# EasyEDA Pro project 学期项目.epro, board PCB3
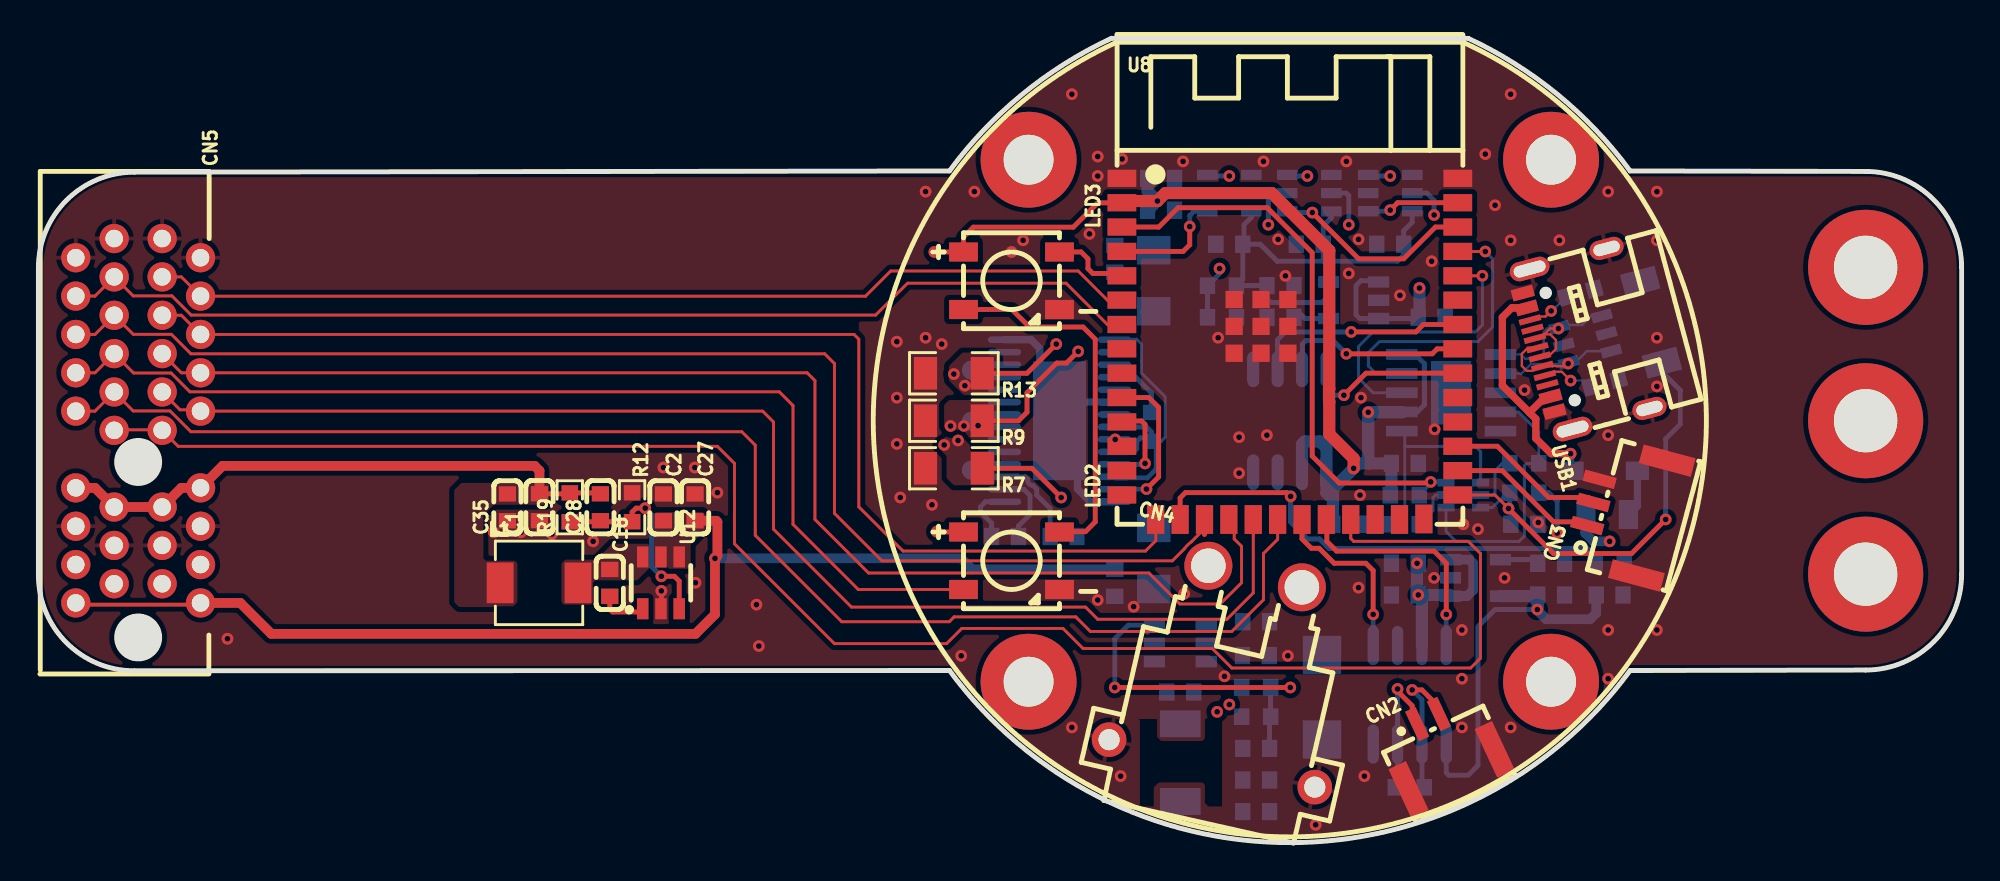
[diagram p15: board, top side]
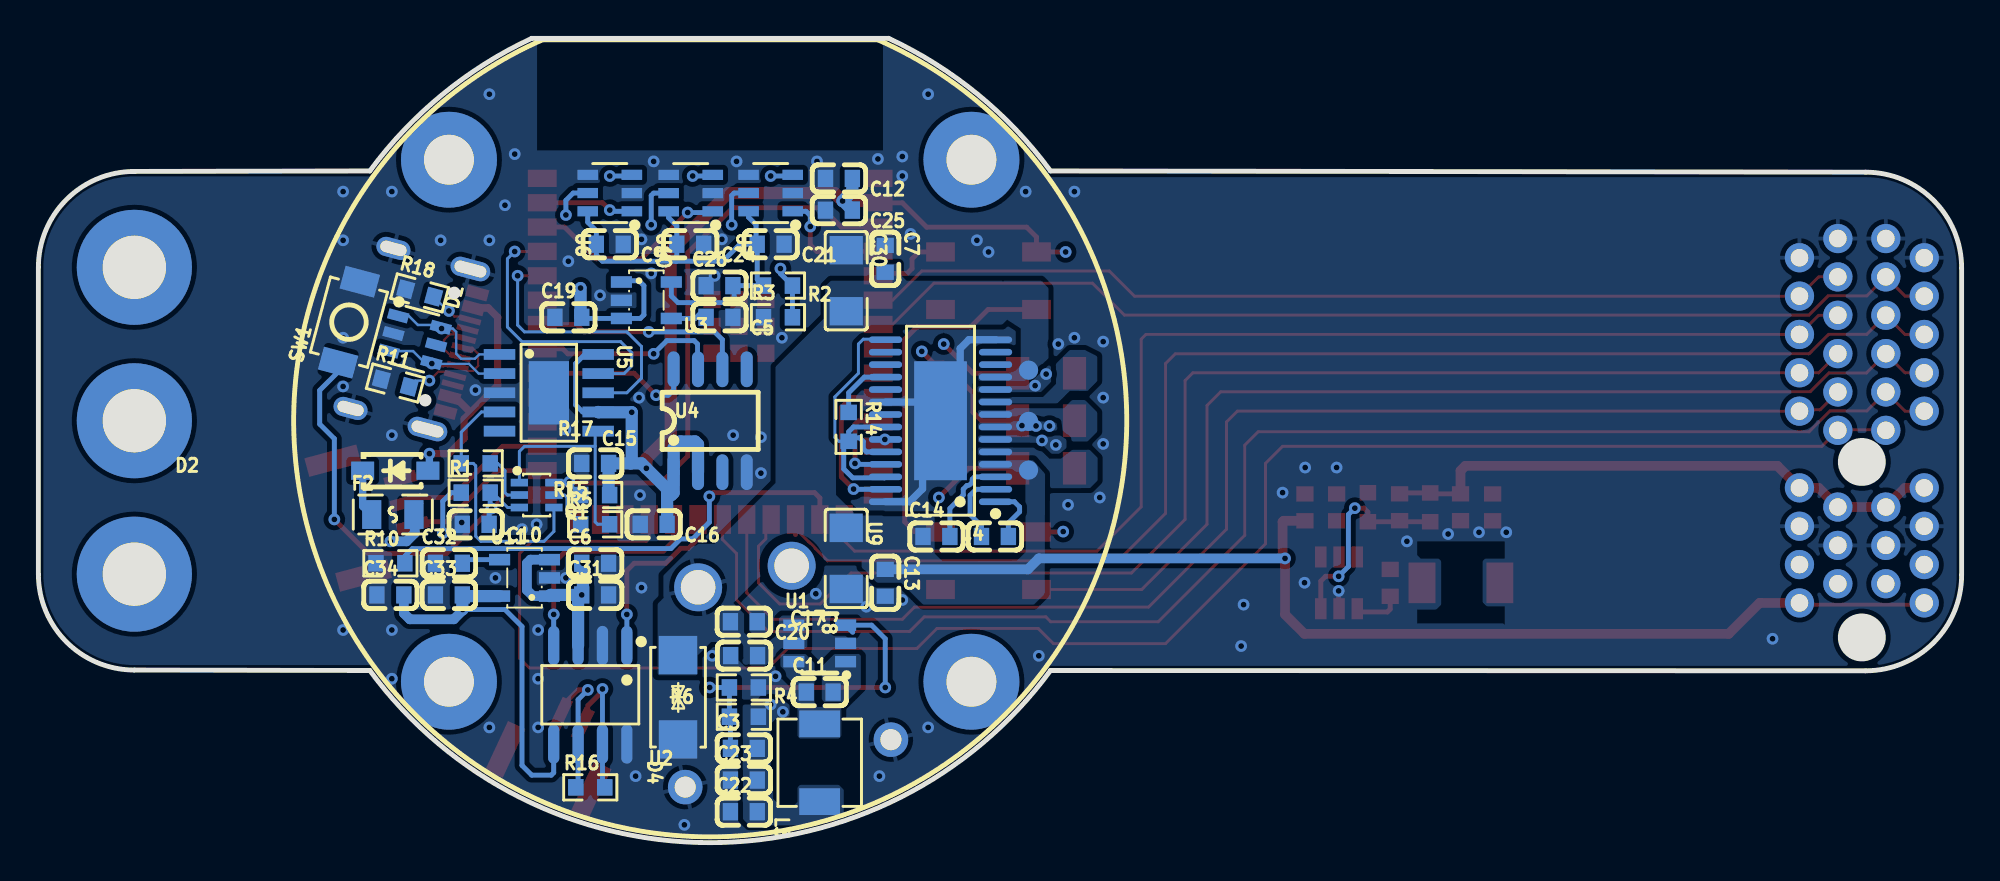
[diagram p16: board, bottom side, seen from below]

Outline 100.2 x 41.94 mm; copper layers: Top Layer, Inner1, Inner2, Bottom Layer. Coordinates in mm from the lower left corner of the outline.
Outline path: 0,29.96 arc(1.46,33.5) 5,34.96 47.47,35.02 arc(51.25,39.01) 55.9,41.94 74.5,41.94 arc(79.15,39.01) 82.93,35.02 95.2,35 arc(98.73,33.54) 100.2,30 100.2,14 arc(98.73,10.46) 95.2,9 82.93,8.98 arc(65.2,0) 47.47,8.98 5,8.96 arc(1.46,10.43) 0,13.96 0,29.96
Stack: Top Layer 0.035mm Outer layer thickness 1oz / Dielectric1 0.2104mm 7628 RC49% 8.6mil / Inner1 0.0152mm Inner layer thickness / Dielectric2 1.065mm 1.1mm H/HOZ Copper / Inner2 0.0152mm Inner layer thickness / Dielectric3 0.2104mm 7628 RC49% 8.6mil / Bottom Layer 0.035mm Outer layer thickness 1oz

## Design rules (mm)
spacing copperThickness1oz (default): track to track 0.102, other pairs 0.152 to 0.3
spacing copperThickness2oz: track to track 0.203, other pairs 0.152 to 0.3
track width copperThickness1oz (default): min 0.102, default 0.254, max 2.54
track width copperThickness2oz: min 0.203, default 0.254, max 2.54
differential pair differentialPair (default): width min 0.127, default 0.254, max 2.54; gap min 0.152, default 0.152
net GND uses copperRegion

## Placement (name value [footprint] x y rotation side)
C1  10uF  [C0603]  26.11 17.49 90 top
C2  100nF  [C0603]  32.56 17.48 270 top
C3  100pF  [C0603]  63.44 4.92 180 bottom
C4  10nF  [C0603]  50.36 15.97 180 bottom
C5  -  [C0603]  64.71 27.4 0 bottom
C6  100nF  [C0603]  71.19 14.57 180 bottom
C7  100nF  [C0603]  56.08 30.44 270 bottom
C8  100uF  [C1206]  58.11 14.82 90 bottom
C9  100nF  [C0603]  70.43 31.21 0 bottom
C10  1uF  [C0603]  77.41 16.6 0 bottom
C11  100nF  [C0603]  59.49 7.85 180 bottom
C12  10uF  [C0603]  58.49 34.63 0 bottom
C13  100nF  [C0603]  56.08 13.55 270 bottom
C14  100nF  [C0603]  53.41 15.97 180 bottom
C15  100nF  [C0603]  71.19 19.78 180 bottom
C16  100nF  [C0603]  68.14 16.6 0 bottom
C17  100nF  [C0603]  63.43 9.76 180 bottom
C18  100nF  [C0603]  29.77 13.55 270 top
C19  1uF  [C0603]  72.59 27.4 180 bottom
C20  22uF  [C0603]  63.44 11.52 0 bottom
C21  100nF  [C0603]  62.05 31.21 0 bottom
C22  100nF  [C0603]  63.44 1.61 180 bottom
C23  10uF  [C0603]  63.44 3.27 180 bottom
C24  100nF  [C0603]  66.24 31.21 0 bottom
C25  100nF  [C0603]  58.49 32.98 0 bottom
C26  -  [C0603]  64.71 29.05 180 bottom
C27  22uF  [C0603]  34.21 17.48 270 top
C28  100pF  [C0603]  29.28 17.49 90 top
C30  100uF  [C1206]  58.11 29.3 270 bottom
C31  10uF  [C0603]  71.19 12.92 180 bottom
C32  -  [C0603]  78.81 14.57 180 bottom
C33  100nF  [C0603]  78.81 12.92 180 bottom
C34  -  [C0603]  81.86 12.92 180 bottom
C35  100nF  [C0603]  24.43 17.48 90 top
CN2  WAFER-GH1.25-2PWB  [CONN-TH_2P-P1.25_XUNPU_WAFER-GH1.25-2PWB]  73.01 5.13 25 top
CN3  WAFER-GH1.25-3PWB  [CONN-TH_3P-P1.25_GH1.25]  82.54 17.33 75 top
CN4  XT30PW-M30.G.Y  [CONN-TH_XT30PW-M]  62.27 9 347 top
CN5  3183-10110P1T  [CONN-TH_36P-P1.00-V_3183-XXXXXPXT]  5.2 22 270 top
D1  USBLC6-2SC6  [SOT-23-6_L2.9-W1.6-P0.95-LS2.8-BL]  80.59 26.25 285 bottom
D2  B5819W SL  [SOD-123_L2.7-W1.6-LS3.7-RD-1]  81.61 19.39 180 bottom
D4  SMAJ40CA  [SMA_L4.3-W2.6-LS5.0-BI]  66.87 7.58 90 bottom
F2  JK-SMD0805-100  [F0805]  81.73 17.11 180 bottom
L1  10uH  [IND-SMD_L4.4-W4.2]  26.09 13.55 0 top
L3  10uH  [IND-SMD_L4.4-W4.2]  59.49 4.17 90 bottom
LED2  XL-5050RGBC-WS2812B  [LED-SMD_4P-L5.0-W5.0-BL_XL-5050RGBC]  50.7 14.7 270 top
LED3  XL-5050RGBC-WS2812B  [LED-SMD_4P-L5.0-W5.0-BL_XL-5050RGBC]  50.7 29.3 270 top
MARK2  -  [Mark-Point-1mm]  46.07 24.64 180 bottom
MARK3  -  [Mark-Point-1mm]  46.07 19.42 180 bottom
MARK4  -  [Mark-Point-1mm]  46.07 21.97 180 bottom
NOREF  -  [Pad_e678]  78.81 8.39 0 top
NOREF#2  -  [Pad_e679]  95.2 14 0 top
NOREF#3  -  [Pad_e676]  51.59 8.39 0 top
NOREF#4  -  [Pad_e681]  95.2 22 0 top
NOREF#5  -  [Pad_e677]  78.81 35.61 0 top
NOREF#6  -  [Pad_e680]  95.2 30 0 top
NOREF#7  -  [Pad_e675]  51.59 35.61 0 top
Q1  LMBT3904DW1T1G  [SOT-363_L2.0-W1.3-P0.65-LS2.1-BR]  74.24 18.12 0 bottom
R1  10kΩ  [R0603]  77.41 18.25 180 bottom
R2  1K  [R0603]  61.67 29.05 0 bottom
R3  1K  [R0603]  61.67 27.4 180 bottom
R4  3K  [R0603]  63.44 8.09 0 bottom
R5  10kΩ  [R0603]  71.19 16.6 180 bottom
R6  22K  [R0603]  63.44 6.57 180 bottom
R7  50mΩ  [R1206]  47.7 19.52 180 top
R9  50mΩ  [R1206]  47.7 22 180 top
R10  10kΩ  [R0603]  81.86 14.57 180 bottom
R11  5.1K  [R0603]  81.61 23.97 195 bottom
R12  10K  [R0603]  30.93 17.49 270 top
R13  50mΩ  [R1206]  47.7 24.47 180 top
R14  10K  [R0603]  57.98 21.68 270 bottom
R15  10kΩ  [R0603]  71.19 18.12 0 bottom
R16  120  [R0603]  71.45 2.88 180 bottom
R17  10kΩ  [R0603]  77.41 19.78 0 bottom
R18  5.1K  [R0603]  80.33 28.67 195 bottom
R19  43K  [R0603]  27.68 17.48 90 top
SW1  TS-1088-AR02016  [SW-SMD_L3.9-W3.0-P4.45]  84.02 27.14 105 bottom
U1  ME3121AM6G  [SOT-23-6_L2.9-W1.6-P0.95-LS2.8-BR]  59.49 10.39 180 bottom
U2  TJA1051T/3/1J  [SOIC-8_L4.9-W3.9-P1.27-LS6.0-BL]  71.45 7.71 0 bottom
U3  RS3236-3.3AYF5  [SOT-23-5_L3.0-W1.7-P0.95-LS2.8-BR]  68.52 28.28 0 bottom
U4  MT6701CT-STD  [SOP-8_L4.9-W3.9-P1.27-LS6.0-BL]  65.2 22 180 bottom
U5  CH340K  [ESOP-10_L4.9-W3.9-P1.00-LS6.0-BL-EP]  73.6 23.46 270 bottom
U6  INA181A2IDBVR  [SOT-23-6_L2.9-W1.6-P0.95-LS2.8-BL]  70.43 33.87 90 bottom
U7  INA181A2IDBVR  [SOT-23-6_L2.9-W1.6-P0.95-LS2.8-BL]  62.05 33.87 90 bottom
U8  ESP32-S3-WROOM-1-N16R8  [WIRELM-SMD_ESP32-S3-WROOM-1]  65.2 25.74 0 top
U9  DRV8313PWPR  [HTSSOP-28_L9.8-W4.5-P0.65-LS6.6-BL-EP]  53.2 22 90 bottom
U10  INA181A2IDBVR  [SOT-23-6_L2.9-W1.6-P0.95-LS2.8-BL]  66.21 33.87 90 bottom
U11  RS3236-3.3AYF5  [SOT-23-5_L3.0-W1.7-P0.95-LS2.8-BR]  74.87 13.81 180 bottom
U12  ME3121AM6G  [SOT-23-6_L2.9-W1.6-P0.95-LS2.8-BR]  32.44 13.55 270 top
USB1  TYPEC-304-ACP16  [USB-C-SMD_TYPE-C-16P-1_1]  80.49 26.19 105 top

## Footprints (pads in the part's own frame, mm; a bottom-side part is the same pattern mirrored in y, then rotated)
C0603
  rect 0.8x0.9 smd: 1(-0.7,0) 2(0.7,0)
C1206
  rect 1.485x1.728 smd: 1(-1.593,0) 2(1.593,0)
CONN-TH_2P-P1.25_XUNPU_WAFER-GH1.25-2PWB
  rect 0.6x1.7 smd: 1(-0.625,1.45) 2(0.625,1.45)
  rect 1x2.8 smd: 3(-2.475,-1.45) 4(2.475,-1.45)
CONN-TH_3P-P1.25_GH1.25
  rect 0.6x1.7 smd: 1(-1.25,1.575) 2(0,1.575) 3(1.25,1.575)
  rect 1x2.8 smd: 4(3.1,-1.575) 5(-3.1,-1.575)
CONN-TH_36P-P1.00-V_3183-XXXXXPXT
  round 1.524 hole 0.914: A1(-9.5,1.25) A2(-8.5,3.25) A3(-7.5,1.25) A4(-6.5,3.25) A5(-5.5,1.25) A6(-4.5,3.25) A7(-3.5,1.25) A8(-2.5,3.25) A9(-1.5,1.25) A10(-0.5,3.25) A11(0.5,1.25) A12(3.5,3.25) A13(4.5,1.25) A14(5.5,3.25) A15(6.5,1.25) A16(7.5,3.25) A17(8.5,1.25) A18(9.5,3.25) B1(-9.5,-1.25) B2(-8.5,-3.25) B3(-7.5,-1.25) B4(-6.5,-3.25) B5(-5.5,-1.25) B6(-4.5,-3.25) B7(-3.5,-1.25) B8(-2.5,-3.25) B9(-1.5,-1.25) B10(-0.5,-3.25) B11(0.5,-1.25) B12(3.5,-3.25) B13(4.5,-1.25) B14(5.5,-3.25) B15(6.5,-1.25) B16(7.5,-3.25) B17(8.5,-1.25) B18(9.5,-3.25)
CONN-TH_XT30PW-M
  round 2.5 hole 1.8: 1(-2.5,5) 2(2.5,5)
  round 1.8 hole 1.1: 3(5.5,-5) 4(-5.5,-5)
ESOP-10_L4.9-W3.9-P1.00-LS6.0-BL-EP
  rect 0.56x1.64 smd: 1(-2,-2.57) 2(-1,-2.57) 3(0,-2.57) 4(1,-2.57) 5(2,-2.57) 6(2,2.57) 7(1,2.57) 8(0,2.57) 9(-1,2.57) 10(-2,2.57)
  rect 3.3x2.1 smd: 11(0,0)
F0805
  rect 1x1.5 smd: 1(-1.1,0) 2(1.1,0)
HTSSOP-28_L9.8-W4.5-P0.65-LS6.6-BL-EP
  oval 0.343x1.732 smd: 1(-4.225,-2.866) 2(-3.575,-2.866) 3(-2.925,-2.866) 4(-2.275,-2.866) 5(-1.625,-2.866) 6(-0.975,-2.866) 7(-0.325,-2.866) 8(0.325,-2.866) 9(0.975,-2.866) 10(1.625,-2.866) 11(2.275,-2.866) 12(2.925,-2.866) 13(3.575,-2.866) 14(4.225,-2.866) 15(4.225,2.866) 16(3.575,2.866) 17(2.925,2.866) 18(2.275,2.866) 19(1.625,2.866) 20(0.975,2.866) 21(0.325,2.866) 22(-0.325,2.866) 23(-0.975,2.866) 24(-1.625,2.866) 25(-2.275,2.866) 26(-2.925,2.866) 27(-3.575,2.866) 28(-4.225,2.866)
  rect 6.2x2.75 smd: 29(0,0)
IND-SMD_L4.4-W4.2
  rect 1.4x2.12 smd: 1(2.028,0) 2(-2.028,0)
LED-SMD_4P-L5.0-W5.0-BL_XL-5050RGBC
  rect 1x1.5 smd: 1(-1.5,-2.5) 2(1.5,-2.5) 3(1.5,2.5) 4(-1.5,2.5)
Mark-Point-1mm
  round 1 smd: 1(-2.54,0)
Pad_e675
  round 5 hole 2.6: 1(0,0)
Pad_e676
  round 5 hole 2.6: 1(0,0)
Pad_e677
  round 5 hole 2.6: 1(0,0)
Pad_e678
  round 5 hole 2.6: 1(0,0)
Pad_e679
  round 6 hole 3.3: 1(0,0)
Pad_e680
  round 6 hole 3.3: 1(0,0)
Pad_e681
  round 6 hole 3.3: 1(0,0)
R0603
  rect 0.806x0.864 smd: 1(-0.753,0) 2(0.753,0)
R1206
  rect 1.208x1.701 smd: 1(-1.479,0) 2(1.479,0)
SMA_L4.3-W2.6-LS5.0-BI
  rect 2x2 smd: 1(-2.2,0) 2(2.2,0)
SOD-123_L2.7-W1.6-LS3.7-RD-1
  rect 1.2x0.95 smd: 1(-1.7,0) 2(1.7,0)
SOIC-8_L4.9-W3.9-P1.27-LS6.0-BL
  oval 0.588x2.045 smd: 1(-1.905,-2.57) 2(-0.635,-2.57) 3(0.635,-2.57) 4(1.905,-2.57) 5(1.905,2.57) 6(0.635,2.57) 7(-0.635,2.57) 8(-1.905,2.57)
SOP-8_L4.9-W3.9-P1.27-LS6.0-BL
  oval 0.63x1.865 smd: 1(-1.905,-2.683) 2(-0.635,-2.683) 3(0.635,-2.683) 4(1.905,-2.683) 5(1.905,2.683) 6(0.635,2.683) 7(-0.635,2.683) 8(-1.905,2.683)
SOT-23-5_L3.0-W1.7-P0.95-LS2.8-BR
  rect 1.1x0.6 smd: 1(1.3,-0.95) 2(1.3,0) 3(1.3,0.95) 4(-1.3,0.95) 5(-1.3,-0.95)
SOT-23-6_L2.9-W1.6-P0.95-LS2.8-BL
  rect 0.532x1.072 smd: 1(-0.95,-1.149) 2(0,-1.149) 3(0.95,-1.149) 4(0.95,1.149) 5(0,1.149) 6(-0.95,1.149)
SOT-23-6_L2.9-W1.6-P0.95-LS2.8-BR
  rect 1.1x0.6 smd: 1(1.35,-0.95) 2(1.35,0) 3(1.35,0.95) 4(-1.35,0.95) 5(-1.35,0) 6(-1.35,-0.95)
SOT-363_L2.0-W1.3-P0.65-LS2.1-BR
  rect 0.9x0.4 smd: 1(0.9,-0.65) 2(0.9,0) 3(0.9,0.65) 4(-0.9,0.65) 5(-0.9,0) 6(-0.9,-0.65)
SW-SMD_L3.9-W3.0-P4.45
  rect 1.23x1.86 smd: 1(-2.185,0) 2(2.185,0)
USB-C-SMD_TYPE-C-16P-1_1
  rect 0.6x1.15 smd: A1B12(-3.2,2.41) A4B9(-2.4,2.41) B1A12(3.2,2.41) B4A9(2.4,2.41)
  rect 0.3x1.15 smd: A5(-1.25,2.41) A6(-0.25,2.41) A7(0.25,2.41) A8(1.25,2.41) B5(1.75,2.41) B6(0.75,2.41) B7(-0.75,2.41) B8(-1.75,2.41)
  oval 1x2.1 hole 0.6x1.7: EP(-4.32,1.74) EP(4.32,1.74)
  oval 1x1.8 hole 0.6x1.4: EP(-4.32,-2.41) EP(4.32,-2.41)
WIRELM-SMD_ESP32-S3-WROOM-1
  rect 1.5x0.9 smd: 1(-8.75,8.895) 2(-8.75,7.625) 3(-8.75,6.355) 4(-8.75,5.085) 5(-8.75,3.815) 6(-8.75,2.545) 7(-8.75,1.275) 8(-8.75,0.005) 9(-8.75,-1.265) 10(-8.75,-2.535) 11(-8.75,-3.805) 12(-8.75,-5.075) 13(-8.75,-6.345) 14(-8.75,-7.615) 27(8.75,-7.615) 28(8.75,-6.345) 29(8.75,-5.075) 30(8.75,-3.805) 31(8.75,-2.535) 32(8.75,-1.265) 33(8.75,0.005) 34(8.75,1.275) 35(8.75,2.545) 36(8.75,3.815) 37(8.75,5.085) 38(8.75,6.355) 39(8.75,7.625) 40(8.75,8.895)
  rect 0.9x1.5 smd: 15(-6.985,-8.895) 16(-5.715,-8.895) 17(-4.445,-8.895) 18(-3.175,-8.895) 19(-1.905,-8.895) 20(-0.635,-8.895) 21(0.635,-8.895) 22(1.905,-8.895) 23(3.175,-8.895) 24(4.445,-8.895) 25(5.715,-8.895) 26(6.985,-8.865)
  rect 0.9x0.9 smd: 41(-2.9,2.575) 41(-2.9,1.175) 41(-2.9,-0.225) 41(-1.5,2.575) 41(-1.5,1.175) 41(-1.5,-0.225) 41(-0.1,2.575) 41(-0.1,1.175) 41(-0.1,-0.225)

## Nets
+5V: C3.2 C6.1 C19.2 C22.2 C23.2 C31.1 L3.2 R6.2 U2.3 U3.1 U3.3 U11.1 U11.3
AVCC: C9.2 C21.2 C24.2 C26.2 R2.2 U3.5 U6.6 U7.6 U10.6
GND: C1.1 C2.1 C5.1 C6.2 C7.1 C8.1 C9.1 C10.2 C12.2 C13.2 C15.1 C16.2 C17.1 C19.1 C20.1 C21.1 C22.1 C23.1 C24.1 C25.2 C26.1 C27.1 C30.1 C31.2 C32.1 C33.1 C34.1 C35.1 CN2.3 CN2.4 CN3.3 CN3.4 CN3.5 CN4.1 CN4.3 CN4.4 CN5.A1 CN5.A2 CN5.A14 CN5.A15 CN5.B1 CN5.B2 CN5.B14 CN5.B15 D1.2 D4.1 LED2.3 LED3.3 R3.1 R4.1 R7.2 R9.2 R10.1 R11.1 R12.1 R13.2 R18.1 SW1.2 U1.2 U2.2 U2.8 U3.2 U4.4 U5.3 U5.11 U6.2 U6.4 U7.2 U7.4 U8.1 U8.40 U8.41 U9.14 U9.20 U9.28 U9.29 U10.2 U10.4 U11.2 U12.2 USB1.A1B12 USB1.B1A12 USB1.EP
PVCC: C2.2 C7.2 C8.2 C13.1 C14.1 C17.2 C20.2 C27.2 C30.2 CN4.2 CN5.A18 CN5.B18 D4.2 U1.4 U1.5 U9.4 U9.11 U12.4 U12.5
VBUS: D2.2 USB1.A4B9 USB1.B4A9
VCC: C12.1 C15.2 C16.1 C25.1 C33.2 C34.2 LED2.1 LED3.1 R1.1 R15.1 U2.5 U4.1 U4.2 U5.7 U5.10 U8.2 U11.5
CAN_RX: U2.4 U8.22
CAN_TX: U2.1 U8.21
CANH: CN2.1 R16.2 U2.7
CANL: CN2.2 R16.1 U2.6
CH340_D+: D1.1 D1.6 U5.1 USB1.A6 USB1.B6
CH340_D-: D1.3 D1.4 U5.2 USB1.A7 USB1.B7
CUR_A: U6.1 U8.39
CUR_B: U8.38 U10.1
CUR_C: U7.1 U8.4
DTR: Q1.4 R17.2 U5.4
INA: U8.10 U9.27
INB: U8.11 U9.25
INC: U8.12 U9.23
IO0_BOOT: C10.1 Q1.3 R1.2 SW1.1 U8.27
IO3_DVP_VSYNC: CN5.A5 CN5.A6 U8.15
IO5_DVP_XCLK: LED3.4 U8.5
IO6_DVP_D5: CN5.A3 CN5.A4 U8.6
IO7_DVP_PCLK: CN5.B3 CN5.B4 U8.7
IO9_DVP_D7: CN5.B5 CN5.B6 U8.17
IO10: CN5.A7 CN5.A8 U8.18
IO11: CN5.A9 CN5.A10 U8.19
IO12_I2S_DI: CN5.B9 CN5.B10 U8.20
IO15_DVP_D4: U8.8
IO16_DVP_D0: U8.9
IO19_USB_D-: U8.13
IO20_USB_D+: U8.14
IO21_SD_DAT0: CN5.A11 CN5.B11 U8.23
IO35: CN3.1 U8.28
IO36: CN3.2 U8.29
IO37: U8.30
IO38_I2S_MCK: U8.31
IO39_LCD_DC: U4.8 U8.32
IO40_LCD_MOSI: U4.7 U8.33
IO41_LCD_SCK: U4.6 U8.34
IO42_LCD_BL: U8.35
IO45_I2S_DO: U8.26
IO46_DVP_HREF: R10.2 U8.16
IO47_SD_CLK: U8.24
IO48_SD_CMD: U8.25
LIGHTVCC: C1.2 C28.2 C35.2 CN5.A12 CN5.A13 CN5.B12 CN5.B13 L1.2 R19.2
ME3121_FB: C3.1 R4.2 R6.1 U1.3
ME3121_FB2: C28.1 R12.2 R19.1 U12.3
NFAULT: R14.1 U9.18
NRESET: U9.16
NSLEEP: U9.17
OUT1: U9.5
OUT2: U9.8
OUT3: U9.9
REF: R2.1 R3.2 U6.5 U7.5 U10.5
RESET: Q1.6 R15.2 U8.3
RTS: Q1.1 R5.2 U5.6
SP1: R7.1 U6.3 U9.6
SP2: R9.1 U9.7 U10.3
SP3: R13.1 U7.3 U9.10
U0RXD: U5.8 U8.36
U0TXD: U5.9 U8.37
USB5V: D1.5
WS2812_OUTPUT: CN5.B7 CN5.B8 LED2.2
$1N93: C11.2 U1.1
$1N94: C11.1 L3.1 U1.6
$1N259: C14.2 U9.3
$1N276: R14.2 U9.15 U9.22 U9.24 U9.26
$1N288: C4.1 U9.2
$1N289: C4.2 U9.1
$1N292: C5.2 U3.4
$2N43: C32.2 U11.4
$2N107: Q1.5 R5.1
$2N108: Q1.2 R17.1
$2N111: D2.1
$2N115: R18.2 USB1.B5
$2N119: R11.2 USB1.A5
$2N147: LED2.4 LED3.2
$3N7: C18.2 U12.1
$3N8: C18.1 L1.1 U12.6

Pads without a net: CN5 A16 A17 B16 B17; F2 1 2; MARK2 1; MARK3 1; MARK4 1; NOREF 1; NOREF#2 1; NOREF#3 1; NOREF#4 1; NOREF#5 1; NOREF#6 1; NOREF#7 1; U4 3 5; U5 5; U9 12 13 19 21; USB1 A8 B8

## Via types
v1: diameter 0.61, hole 0.305, Top Layer to Bottom Layer, 138 vias

## Routing (per net, layer and track width the routed paths; a pad name or vN(x,y) marks a point on that pad's centre or on a via; arc(x,y) is an arc through that point)
+5V: length 70.1
  Inner1 w0.508: v1(71.89,12.92) 73.73,12.92 75.25,11.39 78.94,11.39 79.57,12.03 79.57,14.44 80.84,15.71 v1(81.86,15.71)
  Inner1 w0.635: v1(61.41,6.82) 61.67,6.82 v1(62.05,7.2) 68.02,7.2 71.83,11.01 v1(71.83,14.57) 71.83,18.25 67.13,22.95 67.13,27.14 67.64,27.65 71.45,27.65 71.95,28.16 v1(71.95,28.92)
  Bottom Layer w0.254: U3.1 69.76,29.3 68.9,29.3 68.65,29.05 68.65,27.52 68.84,27.33 U3.3 71.83,27.33
  Bottom Layer w0.508: U11.3 74.56,14.76 74.75,14.57 74.75,13.17 74.43,12.86 U11.1 ; 80.59,16.98 80.59,16.14 81.02,15.71 v1(81.86,15.71)
  Bottom Layer w0.635: v1(71.89,12.92) 71.83,12.98 v1(71.83,14.57) ; v1(71.89,12.92) 72.08,12.73 U2.3 ; v1(71.89,12.92) 73.51,12.92 U11.1 ; 80.59,17.11 80.59,16.98 ; v1(71.95,28.92) 71.95,27.46 C19.2
AVCC: length 24.8
  Bottom Layer w0.254: 66.96,30.32 70.81,30.32 71.13,30.64 71.13,31.91 71.58,32.35 U6.6 ; 66.96,30.32 66.94,30.34 C24.2 66.94,32.16 67.36,32.58 U10.6 ; 66.96,30.32 64.54,30.32 63.65,31.21 C21.2 ; C21.2 62.81,31.27 62.81,32.22 63.2,32.61 U7.6 ; C21.2 62.75,29.37 R2.2 C26.2 63.95,28.98 63.95,28.41 64.21,28.16 66.87,28.16 67.22,28.51 U3.5
GND: length 16.6
  Top Layer w0.254: U12.2 32.46,12.22 v1(32.46,13.13)
  Bottom Layer w0.381: U9.14 51.72,26.23 52.17,25.77 52.17,23.03 52.7,22.5 U9.29 ; U9.28 54.81,17.78 54.14,18.45 54.14,21.06 53.7,21.5 U9.29 ; U9.29 54.17,22.98 U9.20
  vias: v1(9.85,10.63) v1(23.72,16.18) v1(25.14,16.18) v1(26.75,16.09) v1(28.9,15.71) v1(32.56,19.56) v1(34.2,19.56) v1(34.23,13.55) v1(35.38,18.25) v1(37.41,12.41) v1(37.54,10.25) v1(44.72,26.13) v1(44.72,23.2) v1(44.72,20.79) v1(44.9,18) v1(46.22,33.95) v1(46.22,26.33) v1(46.55,17.62) v1(47.06,26) v1(48.08,9.74) v1(48.76,33.95) v1(50.7,30.8) v1(51.3,31.41) v1(53.84,39.03) v1(53.84,6.01) v1(54.76,31.74) v1(55.19,35.78) v1(55.19,34.76) v1(55.19,12.65) v1(56.38,3.47) v1(56.46,35.65) v1(57.06,12.3) v1(59.63,35.52) v1(59.69,12.98) v1(61.46,26.33) v1(61.79,8.68) v1(62.55,21.14) v1(62.55,19.27) v1(63.83,35.52) v1(64,21.25) v1(64.59,31.46) v1(64.97,29.55) v1(65.09,9.74) v1(66.54,0.93) v1(68.14,35.52) v1(68.27,29.68) v1(68.78,31.46) v1(68.78,13.3) v1(68.9,23.2) v1(68.85,18.12) v1(69.08,3.47) v1(70.94,28.54) v1(72.59,30.32) v1(72.74,21.55) v1(72.71,13.81) v1(74.24,16.6) v1(74.16,11.09) v1(74.16,8.55) v1(74.16,6.01) v1(75,16.35) v1(75.38,35.9) v1(75.89,33.24) v1(76.39,13.81) v1(76.7,39.03) v1(76.7,31.41) v1(76.7,6.01) v1(77.43,23.6) v1(78.14,16.7) v1(79.24,31.41) v1(81.78,33.95) v1(81.78,21.25) v1(81.78,11.09) v1(81.78,8.55) v1(84.32,33.95) v1(84.32,31.41) v1(84.32,26.33) v1(84.32,23.79) v1(84.32,11.09)
PVCC: length 61.6
  Top Layer w0.203: CN5.A18 8.36,12.41 2.04,12.41 CN5.B18
  Top Layer w0.508: CN5.A18 10.52,12.5 12.14,10.89 34.23,10.89 35.25,11.9 v1(35.25,14.82) 35.38,14.95 35.38,16.73 35.32,16.78 C27.2
  Bottom Layer w0.508: C13.1 48.65,14.25 48.08,14.82 v1(35.25,14.82)
VBUS: length 12.7
  Top Layer w0.381: 77.7,22.41 76.27,23.84 76.27,27.4 76.76,27.88 76.78,27.88 arc(76.86,27.88) 76.93,27.88 77.54,27.88 ; 77.7,22.41 77.7,22.44 78.5,23.24 ; 77.7,22.41 78.02,22.1 78.02,21.08 78.81,20.28 v1(79.83,20.28)
  Bottom Layer w0.381: D2.2 79.83,19.47 v1(79.83,20.28)
VCC: length 119
  Top Layer w0.254: 56.44,33.36 55.19,33.36 53.92,32.09 48.71,32.09 48.2,31.58 LED3.1 v1(46.68,30.8) ; v1(46.81,16.22) 46.83,16.2 LED2.1
  Top Layer w0.635: U8.2 56.54,33.46 v1(58.3,33.46) 58.71,33.87 64.26,33.87 67.25,30.88 67.25,23.66 67.24,23.65 67.24,23.01 67.25,23 67.25,21.3 68.52,20.03 v1(68.52,19.52)
  Inner1 w0.254: v1(46.81,16.22) 45.54,16.22 44.14,17.62 44.14,26.76 45.03,27.65 45.03,29.55 46.27,30.8 v1(46.68,30.8)
  Inner1 w0.635: v1(78.09,12.16) 78.09,14.35 77.7,14.74 ; 77.7,14.74 72.86,19.58 72.84,19.58 69.99,22.44 v1(69.29,22.44) ; 77.7,14.74 77.73,14.74 v1(79.13,16.14)
  Bottom Layer w0.254: R1.1 78.68,18.25 79.13,17.81 v1(79.13,16.14) ; U2.5 73.35,3.65 73.48,3.52 74.49,3.52 75,4.03 75,11.27 75.89,12.16 v1(78.09,12.16) ; U5.7 71.84,22.46 72.21,22.82 72.21,24.98 71.73,25.46 U5.10
  Bottom Layer w0.508: C34.2 81.16,11.96 80.84,11.65 78.56,11.65 78.09,12.11
  Bottom Layer w0.635: R15.1 70.49,18.18 C15.2 69.34,19.78 ; 78.11,12.18 C33.2 78.05,12.86 U11.5 ; 57.79,34.63 57.79,33.97 v1(58.3,33.46) 58.27,33.46 57.79,32.98 ; 67.44,18.12 67.22,18.12 67.1,18.24 U4.1 67.1,20.58 66.77,20.92 65.98,20.92 65.83,20.77 U4.2 ; 67.44,18.12 C16.1 ; 67.44,18.12 67.44,18.44 v1(68.52,19.52) 68.78,19.78 69.34,19.78 ; 69.34,19.78 69.29,19.83 v1(69.29,22.44) 71.02,22.44 U5.7
CAN_RX: length 12.1
  Top Layer w0.254: v1(73.35,11.9) 73.35,14.57 72.71,15.2 67.64,15.2 67.13,15.71 67.13,16.83 U8.22
  Bottom Layer w0.254: v1(73.35,11.9) U2.4
CAN_TX: length 9.3
  Top Layer w0.254: v1(69.54,11.9) 69.54,14.19 69.16,14.57 67.51,14.57 66.73,15.35 66.32,15.35 65.83,15.84 U8.21
  Bottom Layer w0.254: v1(69.54,11.9) U2.1
CANH: length 7.4
  Top Layer w0.254: v1(70.81,8.01) 70.81,7.9 71.57,7.14 71.57,6.44 71.83,6.18
  Bottom Layer w0.254: v1(70.81,8.01) U2.7 70.81,3 R16.2
CANL: length 7.5
  Top Layer w0.254: 72.97,6.71 72.97,7.08 72.08,7.96 v1(71.57,7.96)
  Bottom Layer w0.254: R16.1 72.08,3 U2.6 72.08,7.46 v1(71.57,7.96)
CH340_D+: length 10.2
  Top Layer w0.119: 78.46,26.51 78.76,26.51 79.06,26.2 79.06,25.74 78.65,25.33 USB1.A6 ; 78.46,26.51 78.76,26.81 v1(79.19,26.81) ; 78.46,26.51 78.27,26.31
  Bottom Layer w0.119: U5.1 77.23,25.46 77.45,25.24 78.18,25.24 78.43,25.49 78.43,26.63 78.6,26.81 v1(79.19,26.81)
  Bottom Layer w0.127: D1.6 79.35,26.99 80.43,26.99 80.9,27.47 81.45,27.47
CH340_D-: length 10.2
  Top Layer w0.119: 78.06,24.82 77.84,24.6 77.54,24.6 77.29,24.86 77.29,25.49 77.6,25.81 USB1.A7 ; v1(79.7,24.98) 79.56,24.84 79.1,24.84 arc(79.02,24.86) 78.95,24.86 78.89,24.84 USB1.B7
  Bottom Layer w0.119: U5.2 77.26,24.46 77.77,24.97 79.68,24.97 v1(79.7,24.98)
  Bottom Layer w0.127: v1(79.7,24.98) 79.75,25.04 80.08,25.04 80.68,25.63 81.95,25.63
CUR_A: length 4.9
  Top Layer w0.254: v1(70.43,32.98) 70.81,33.37 U8.39
  Bottom Layer w0.254: U6.1 70.37,32.92 v1(70.43,32.98)
CUR_B: length 10.6
  Top Layer w0.254: v1(66.37,32.86) 68.78,30.44 71.13,30.44 72.78,32.1 U8.38
  Bottom Layer w0.254: U10.1 65.13,32.86 v1(66.37,32.86)
CUR_C: length 6.2
  Top Layer w0.254: U8.4 59.64,30.83 59.98,31.17 v1(59.98,32.13)
  Bottom Layer w0.254: U7.1 60.21,32.92 59.98,32.7 v1(59.98,32.13)
DTR: length 14.2
  Bottom Layer w0.152: Q1.4 73.34,16.23 73.86,15.71 77.14,15.71 77.41,15.98 77.41,19.65 77.54,19.78 R17.2 78.17,21.41 77.12,22.46 U5.4
INA: length 8.3
  Top Layer w0.254: U8.10 57.85,23.21 58.36,22.7 58.36,19.07 v1(57.73,18.44)
  Bottom Layer w0.254: U9.27 57.72,18.43 v1(57.73,18.44)
INB: length 4.9
  Top Layer w0.254: v1(57.65,19.77) 57.65,21.81 57.48,21.99 56.5,21.99 U8.11
  Bottom Layer w0.254: U9.25 57.61,19.73 v1(57.65,19.77)
INC:
  vias: v1(56.1,21.03)
IO0_BOOT: length 25.3
  Top Layer w0.152: U8.27 73.95,18.12 75.89,18.12 v1(76.59,17.42)
  Top Layer w0.254: v1(76.59,17.42) 78.94,15.08 83,15.08 v1(84.78,16.85)
  Bottom Layer w0.152: R1.2 76.52,18.25 75.75,17.47 Q1.3
  Bottom Layer w0.254: C10.1 76.71,17.3 v1(76.59,17.42) 76.66,17.49 R1.2 ; SW1.1 84.58,24.54 85.54,23.59 85.54,21.82 84.78,21.06 v1(84.78,16.85)
IO3_DVP_VSYNC: length 63.3
  Top Layer w0.152: CN5.A5 7.45,27.5 CN5.A6 42.49,26.5 42.74,26.25 42.74,17.51 45.05,15.2 57.68,15.2 58.21,15.74 U8.15
IO5_DVP_XCLK: length 4.1
  Top Layer w0.254: LED3.4 54.32,30.8 54.68,30.44 54.68,29.94 54.93,29.68 56.33,29.68 U8.5
IO6_DVP_D5: length 51.6
  Top Layer w0.152: CN5.A3 7.45,29.5 CN5.A4 8.45,28.49 43.09,28.49 44.41,29.81 54.17,29.81 55.69,28.29 U8.6
IO7_DVP_PCLK: length 57.3
  Top Layer w0.152: U8.7 55.69,27.02 53.54,29.17 45.28,29.17 43.62,27.51 7.96,27.51 6.96,28.51 4.94,28.51 CN5.B3 2.95,28.5 CN5.B4
IO9_DVP_D7: length 70.6
  Top Layer w0.152: 60.75,16.37 60.06,15.68 arc(59.87,15.52) 59.71,15.33 59.08,14.7 43.95,14.7 41.47,17.17 41.47,24.98 40.96,25.49 7.94,25.49 6.93,26.51 4.94,26.51 CN5.B5 2.95,26.5 CN5.B6
  Top Layer w0.254: U8.17 60.75,16.07
IO10: length 69.9
  Top Layer w0.152: U8.18 62.3,16.57 62.3,15.84 62.68,15.46 62.68,13.55 61.58,12.45 59.47,12.45 57.86,14.06 43.25,14.06 40.46,16.85 40.46,24.09 40.05,24.5 CN5.A8 7.45,24.5 CN5.A7
IO11: length 69.4
  Top Layer w0.152: CN5.A9 7.38,22.57 8.38,22.57 CN5.A10 37.73,22.5 38.3,21.93 38.3,16.35 42.36,12.28 54.55,12.28 55.19,11.65 61.92,11.65 63.29,13.02 U8.19
IO12_I2S_DI: length 75.6
  Top Layer w0.152: U8.20 64.56,15.81 63.83,15.08 63.83,12.66 62.17,11.01 54.81,11.01 54.05,11.77 47.71,11.77 47.46,11.52 41.85,11.52 37.35,16.03 37.35,20.72 36.65,21.43 7.94,21.43 6.86,22.51 4.94,22.51 CN5.B9 2.95,22.5 CN5.B10
IO21_SD_DAT0: length 93.2
  Top Layer w0.152: 5.89,21.53 4.5,21.53 ; CN5.A11 7.28,20.66 35.38,20.66 36.27,19.78 36.27,15.58 41.47,10.38 47.31,10.38 48.11,11.17 53.38,11.17 54.43,10.12 61.16,10.12 62.17,9.11 74.62,9.11 75.13,9.62 75.13,15.08 74.49,15.71 68.52,15.71 68.37,15.86 U8.23
  Top Layer w0.254: CN5.A11 5.92,21.5 5.89,21.53 ; CN5.B11 4.48,21.5 4.5,21.53
IO35: length 7.9
  Top Layer w0.254: U8.28 76.27,19.4 78.94,16.73 80.5,16.73 CN3.1
IO36: length 8.3
  Top Layer w0.254: CN3.2 80.76,18 78.68,18 76.01,20.67 U8.29
IO39_LCD_DC: length 8.5
  Top Layer w0.254: v1(68.02,23.33) 69.16,24.48 U8.32
  Bottom Layer w0.254: U4.8 67.1,23.61 67.38,23.33 v1(68.02,23.33)
IO40_LCD_MOSI: length 9.9
  Top Layer w0.254: v1(68.14,25.49) 72.62,25.49 72.88,25.75 U8.33
  Bottom Layer w0.254: U4.7 65.86,24.71 65.86,26 66.04,26.18 67.46,26.18 v1(68.14,25.49)
IO41_LCD_SCK: length 11.3
  Top Layer w0.254: U8.34 72.16,27.02 71.77,26.63 v1(68.4,26.63)
  Bottom Layer w0.254: U4.6 64.56,26.23 64.97,26.63 v1(68.4,26.63)
IO46_DVP_HREF: length 25.4
  Top Layer w0.254: U8.16 59.48,17.97 59.76,18.25 65.05,18.25 v1(65.24,18.06)
  Bottom Layer w0.254: R10.2 81.11,14.94 80.72,15.33 77.29,15.33 77.28,15.34 67.24,15.34 66.74,15.84 66.11,15.84 65.24,16.71 v1(65.24,18.06)
LIGHTVCC: length 30
  Top Layer w0.254: C28.2 29.23,18.24 R19.2 27.64,18.19 C1.2
  Top Layer w0.508: CN5.B12 2.95,18.5 CN5.B13 CN5.A13 7.45,18.5 CN5.A12 9.6,19.65 25.85,19.65 26.11,19.39 C1.2
ME3121_FB: length 18.8
  Top Layer w0.254: v1(65.22,8.09) v1(56.08,8.09)
  Bottom Layer w0.254: v1(65.22,8.09) R4.2 R6.1 64.14,6.51 C3.1 ; v1(56.08,8.09) 56.08,10.63 56.79,11.34 U1.3 57.77,10.97
ME3121_FB2: length 10.9
  Top Layer w0.254: R19.1 30.93,16.73 R12.2 30.93,17.24 31.14,17.44 v1(31.61,17.44) ; U12.3 33.39,13.64 33.14,13.89 v1(32.46,13.89)
  Bottom Layer w0.254: v1(31.61,17.44) 31.95,17.11 31.95,14.4 v1(32.46,13.89)
NFAULT: length 3.3
  Bottom Layer w0.254: U9.18 57.17,24.28 57.98,23.46 R14.1
REF: length 22.1
  Inner1 w0.254: v1(61.54,29.94) 63.83,32.22 v1(68.27,32.22) 72.21,32.22 v1(72.71,32.73)
  Bottom Layer w0.254: v1(68.27,32.22) 68.27,33.75 68.15,33.87 U10.5 ; U6.5 72.33,33.87 72.71,33.49 v1(72.71,32.73) ; U7.5 63.95,33.87 64.08,33.75 v1(64.08,32.22) ; R3.2 R2.1 61.54,29.67 v1(61.54,29.94)
RESET: length 30.4
  Top Layer w0.254: v1(72.54,18.81) 72.48,18.75 67.77,18.75 66.36,20.16 66.36,30.76 64.02,33.11 59.38,33.11 58.37,32.1 U8.3
  Bottom Layer w0.152: R15.2 72.54,18.72 v1(72.54,18.81)
  Bottom Layer w0.254: Q1.6 73.3,18.81 v1(72.54,18.81)
RTS: length 11.2
  Bottom Layer w0.152: 71.19,20.68 71.19,21.38 ; 71.19,20.68 71.19,16.73 71.06,16.6 R5.2 ; 71.19,20.68 71.2,20.66 74.87,20.66 75.14,20.4 Q1.1 ; 70.43,21.38 70.38,21.43
SP1: length 33
  Top Layer w0.254: v1(53.28,18) 51.76,19.52 R7.1
  Inner1 w0.254: v1(70.43,34.76) 68.52,34.76 67.51,33.75 63.95,33.75 55.06,24.86 55.06,19.78 v1(53.28,18)
  Bottom Layer w0.254: U6.3 69.34,34.76 v1(70.43,34.76)
  vias: v1(47.19,20.74) v1(47.91,20.97)
SP2: length 23.9
  Top Layer w0.254: R9.1 51.06,22 51.51,22.44 51.51,23.46 53.05,25.01 53.56,25.01 v1(54.17,25.62)
  Inner1 w0.254: v1(54.17,25.62) 54.3,25.62 63.45,34.76 v1(66.11,34.76)
  Bottom Layer w0.254: U10.3 65.12,34.76 v1(66.11,34.76)
  vias: v1(47.52,21.72) v1(48.22,21.73) v1(48.96,21.75)
SP3: length 18.3
  Top Layer w0.254: v1(53.03,26) 51.51,24.47 R13.1
  Inner1 w0.254: v1(62.05,34.76) 61.79,34.76 v1(53.03,26)
  Bottom Layer w0.254: v1(62.05,34.76) 60.96,34.76 U7.3
  vias: v1(47.7,24.43) v1(48.27,23.83)
U0RXD: length 15
  Top Layer w0.152: U8.36 v1(75.23,29.56)
  Bottom Layer w0.152: U5.8 69.54,23.46 68.78,24.22 68.78,25.87 69.54,26.63 74.87,26.63 75.23,26.99 v1(75.23,29.56)
U0TXD: length 15.2
  Top Layer w0.152: U8.37 73.95,30.82 v1(75.38,30.82)
  Bottom Layer w0.152: U5.9 69.68,24.46 69.29,24.86 69.29,25.54 69.87,26.13 75,26.13 75.76,26.89 75.76,30.44 v1(75.38,30.82)
WS2812_OUTPUT: length 55.4
  Top Layer w0.152: CN5.B8 2.95,24.5 CN5.B7 4.96,24.49 6.91,24.49 7.89,23.51 38.6,23.51 39.31,22.79 39.31,16.6 42.71,13.2 LED2.2
$1N259: length 4.8
  Bottom Layer w0.254: U9.3 51.42,19.08 51.54,18.95 51.54,18.9 arc(51.63,18.7) 51.82,18.62 52.01,18.43 52.01,18.12 52.71,17.43 C14.2
$1N276: length 16.7
  Bottom Layer w0.152: U9.15 56.09,26.25 57.22,26.25 57.47,26 57.47,24.47 58.7,23.25 58.7,21.13 58.5,20.93 R14.2
  Bottom Layer w0.254: U9.22 57.73,21.68 57.98,21.43 R14.2 ; R14.2 57.8,21.11 57.41,21.11 57.22,20.92 57.22,20.54 57.06,20.38 U9.24 ; R14.2 58.24,20.67 58.24,19.49 57.77,19.02 56.12,19.02 U9.26
$1N288: length 3.8
  Bottom Layer w0.254: C4.1 51.06,16.51 51.66,17.11 51.66,18.11 51.34,18.43 U9.2
$1N289: length 3.1
  Bottom Layer w0.254: U9.1 49.35,17.78 49.08,17.51 49.08,17.25 49.66,16.67 C4.2
$1N292: length 1.6
  Bottom Layer w0.254: U3.4 65.98,27.33 65.73,27.58
$2N43: length 2
  Bottom Layer w0.254: U11.4 77.92,14.76 C32.2
$2N107: length 2.4
  Bottom Layer w0.152: R5.1 72.66,17.32 72.66,18 72.79,18.12 Q1.5
$2N108: length 2.9
  Bottom Layer w0.152: Q1.2 75.76,18.12 75.89,18.25 75.89,19.39 76.27,19.78 R17.1
$2N111: length 2.5
  Bottom Layer w0.381: 82.87,17.11 83.3,17.54 D2.1
$2N115: length 2.1
  Top Layer w0.119: v1(78.81,27.73) 78.52,27.43 78.16,27.43 78.01,27.28
  Bottom Layer w0.119: v1(78.81,27.73) 78.86,27.73 R18.2
$2N119: length 2.8
  Top Layer w0.119: v1(79.83,24.09) 79.36,24.56 78.96,24.56 78.78,24.38 ; 78.49,24.36 78.78,24.36
  Bottom Layer w0.119: 80.88,23.77 80.56,24.09 v1(79.83,24.09)
$2N147: length 19.1
  Top Layer w0.254: LED3.2 50.72,27.8 51.63,26.89 54.43,26.89 55.06,26.25 55.06,16.73 54.55,16.22 53.22,16.22 LED2.4
$3N7: length 2.1
  Top Layer w0.254: 29.77,12.44 29.77,12.18 29.92,12.03 31.32,12.03 U12.1

## Copper pours and planes (outline as drawn; the poured copper is in the pictures)
+5V on Bottom Layer: 61.06,6.57 61.06,7.17 61.39,7.43 62.43,7.43 62.43,6.19 62.05,6.19 61.67,6.57
+5V on Bottom Layer: 63.5,1.24 63.16,0.9 58.69,0.9 58.24,1.36 58.24,2.76 58.49,3.01 60.52,3.01 60.65,2.88 60.65,2.12 60.8,1.97 61.59,1.97 61.92,2.29 61.92,3.01 62.05,3.14 62.05,5.68 62.06,5.69 62.06,7.2 63.44,7.2 63.5,7.14
GND on Top Layer: -1.83,44.41 101.92,44.41 101.92,-1.69 -1.83,-1.69
GND on Bottom Layer: -7.3,49.11 109.8,49.11 109.8,-5.62 -7.3,-5.62
GND on Inner1: -4.12,46.45 103.96,46.45 103.96,-3.34 -4.12,-3.34
GND on Inner2: -3.1,45.05 102.31,45.05 102.31,-5.12 -3.1,-5.12
PVCC on Top Layer: 33.82,14.28 32.24,14.28 32.08,14.44 32.08,17.11 32.2,17.24 34.61,17.24 34.83,17.02 34.83,16.4 33.99,15.56 33.99,14.45
PVCC on Bottom Layer: 60.14,10.12 60.14,11.69 60.29,11.84 61.45,11.84 61.61,11.68 61.61,10.9 62.09,10.54 62.85,10.54 63.15,10.68 63.43,10.96 63.43,11.94 64.16,12.66 64.33,12.66 65.28,11.71 65.28,11.44 63.32,9.48 63.09,9.23 62.3,9.23 61.54,10 60.27,10
PVCC on Bottom Layer: 67.64,13.93 67.64,12.78 66.36,11.51 64.98,11.51 62.68,13.81 59.19,14.71 56.23,14.71 55.61,15.11 55.61,16.45 56.22,17.06 57.57,17.06 58.64,18.14 58.65,23.24 57.35,24.54 57.35,26.48 56.81,27.01 49.98,27.01 49.6,27.4 49.6,28.92 49.98,29.3 58.91,29.3 59.2,29.01 59.19,27.42 61.79,24.81 61.79,18.76 64.97,15.58 65.98,15.58
PVCC on Bottom Layer: 56.2,17.02 57.31,15.91 57.31,14.35 56.51,13.55 55.25,13.55 54.1,12.41 48.33,12.41 47.77,12.97 47.75,19.23 48.37,19.94 51.25,19.94 51.25,19.52 51.06,19.33 48.98,19.33 48.78,19.23 48.77,15.15 49.22,14.7 53.1,14.67 53.5,15.08 53.5,17.02
PVCC on Bottom Layer: 57.1,29.11 57.03,29.05 54.81,29.05 54.81,29.14 55.37,29.7 55.37,30.19 56.59,30.19 56.59,29.62
PVCC on Bottom Layer: 51.02,24.6 51.23,24.6 51.23,24.07 48.8,24.07 47.57,25.26 47.57,28.92 47.95,29.3 50.01,29.3 50.06,29.25 49.73,28.92 49.74,28.9 49.74,27.28 49.02,26.82 49.02,24.89 49.32,24.59 51.01,24.59
PVCC on Bottom Layer: 64.11,10.47 64.08,10.5 64.08,14.06 66.33,14.06 67.94,12.45 67.94,8.73 65.86,8.73 65.86,9.76 65.15,10.47
LIGHTVCC on Top Layer: 23.31,14.7 24.84,14.7 24.96,14.57 24.96,12.41 24.84,12.28 23.31,12.28 23.31,12.28 21.91,12.28 21.66,12.54 21.66,18.38 22.04,18.76 26.49,18.76 26.61,18.63 26.61,17.74 26.49,17.62 23.72,17.62 23.18,17.08 23.18,14.82
OUT1 on Bottom Layer: 47.62,19.22 47.62,18.48 45.41,18.49 45.01,18.88 45.01,20.07 45.43,20.48 46.34,20.48 46.92,20.02 47.53,20.02 48.1,20.6 51.2,20.61 51.25,20.56 51.25,20.16 51.19,20.09 48.41,20.09
OUT2 on Bottom Layer: 51.17,22.65 51.25,22.57 51.25,21.97 50.77,21.97 50.74,21.93 49.24,21.93 48.98,22.19 47.32,22.19 47.19,22.06 47.19,21.3 46.81,20.92 45.54,20.92 45.03,21.43 45.03,22.44 45.67,23.08 46.35,23.08 46.78,22.65
OUT3 on Bottom Layer: 51.25,22.73 51.23,22.71 51.2,22.75 47.25,22.76 46.46,23.56 45.54,23.55 45.03,24.06 45.03,25.36 45.68,25.69 46.46,25.69 47.19,24.96 47.18,23.92 47.86,23.24 51.05,23.23 51.25,23.08
SP1 on Top Layer: 46.83,20.74 47.39,21.3 48.11,21.3 48.54,20.86 48.54,20.45 48.58,20.41 49.73,20.41 49.86,20.28 49.86,18.76 49.73,18.63 47.7,18.63 47.31,19.01 47.31,20.16 46.83,20.64
SP1 on Bottom Layer: 49.48,20.61 48.06,20.61 47.52,20.08 46.87,20.08 46.64,20.31 46.64,21.02 46.95,21.23 51.13,21.25 51.25,21.17 51.25,20.92 50.99,20.62
SP2 on Top Layer: 49.77,23.08 50.01,22.84 50.01,20.94 49.98,20.92 48.71,20.92 48.28,21.35 47.52,21.35 47.19,21.68 47.19,22.82 47.44,23.08
SP2 on Bottom Layer: 49.75,21.25 49.83,21.17 50.11,21.17 50.09,21.15 48.48,21.15 47.07,21.26 47.15,21.9 47.94,21.97 48.77,21.97 51.09,21.97 51.25,21.81 51.25,21.59 50.92,21.25
SP3 on Top Layer: 47.44,24.86 48.14,25.55 49.76,25.55 50.01,25.3 50.01,23.48 49.86,23.33 48.2,23.33 47.44,24.09
SP3 on Bottom Layer: 51.13,23.29 49.8,23.29 49.8,23.28 47.91,23.28 47.22,23.98 47.22,25.01 47.23,25.01 47.38,25.16 47.56,25.16 48.75,23.97 51.17,23.97 51.28,23.85 51.28,23.85 51.28,23.44
$1N93 on Bottom Layer: 58.19,7.23 57.35,8.08 57.35,9.74 57.47,9.87 58.7,9.87 59.38,9.19 59.38,7.46 59.15,7.23
$1N94 on Bottom Layer: 60.29,9.9 61.38,9.9 61.54,9.74 61.54,8.98 60.79,8.23 60.79,7.09 60.65,6.95 60.65,5.55 60.52,5.42 58.49,5.42 58.36,5.55 58.36,6.96 58.48,7.08 59.63,7.08 59.76,7.2 59.76,9.37
$3N8 on Top Layer: 27.25,12.54 27.25,14.57 27.44,14.76 29.06,14.76 29.89,15.58 31.82,15.58 31.87,15.54 31.87,14.35 31.2,13.68 29.03,13.68 28.9,13.55 28.9,12.54 28.77,12.41 27.38,12.41

Small or netless copper shapes (teardrops, artwork), in the pictures only: 1 on Bottom Layer
